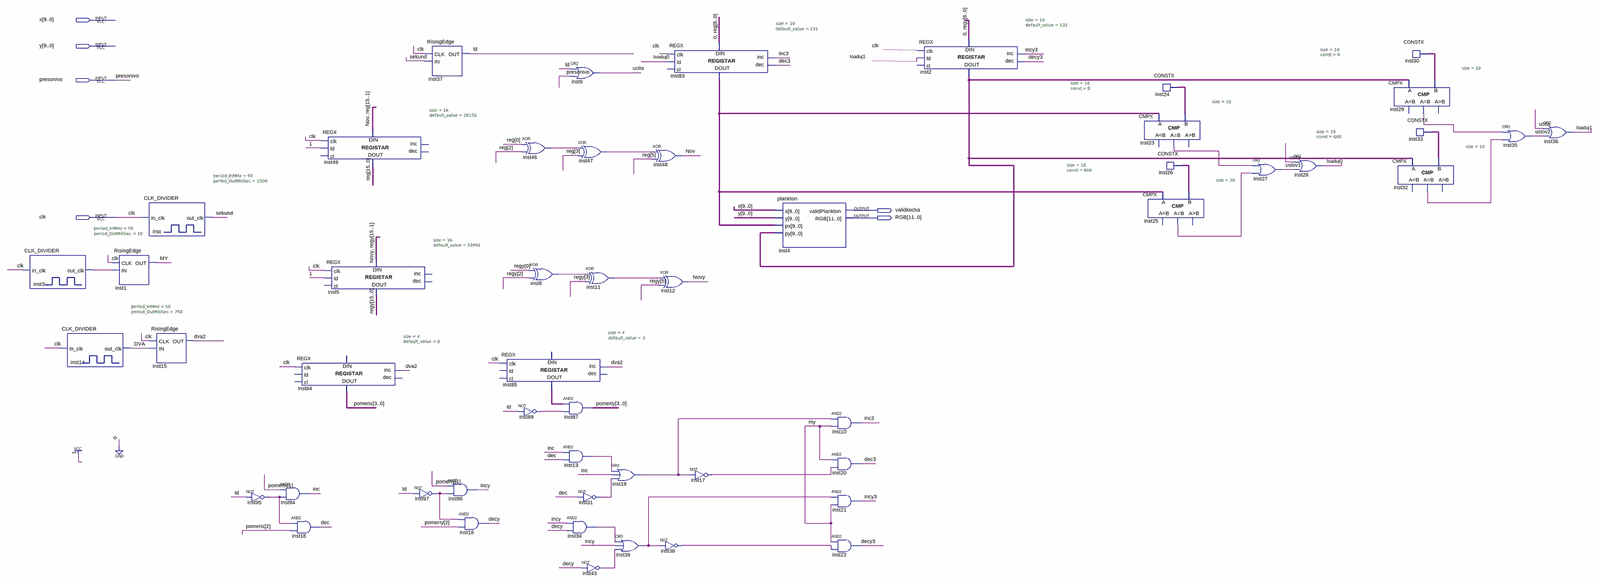
[diagram p0: schematic sheet, whole]
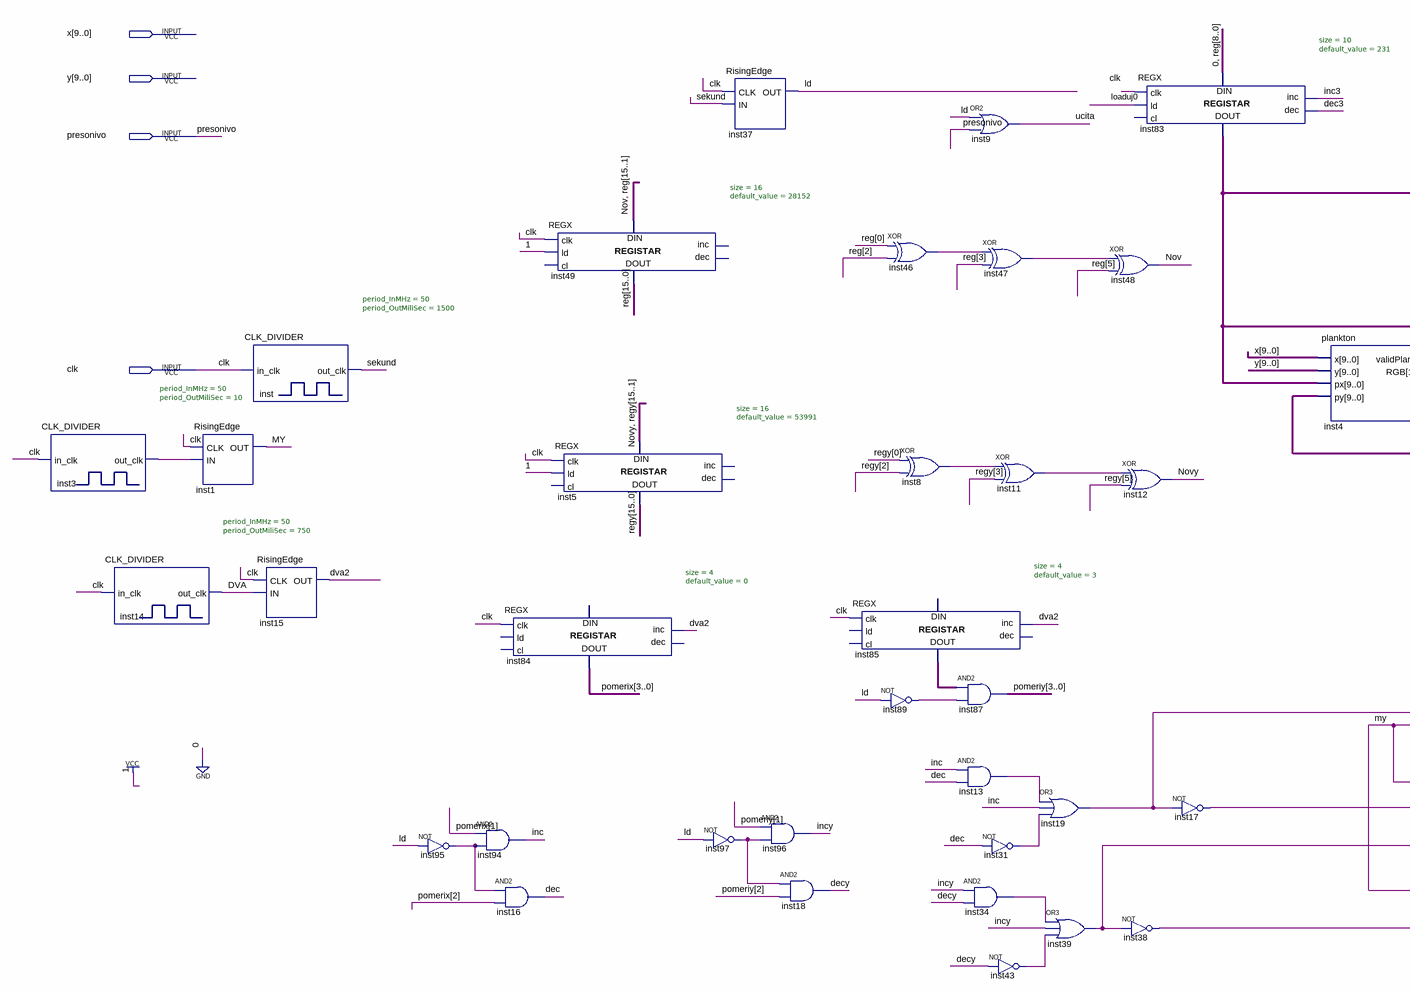
[diagram p1: schematic sheet, left part]
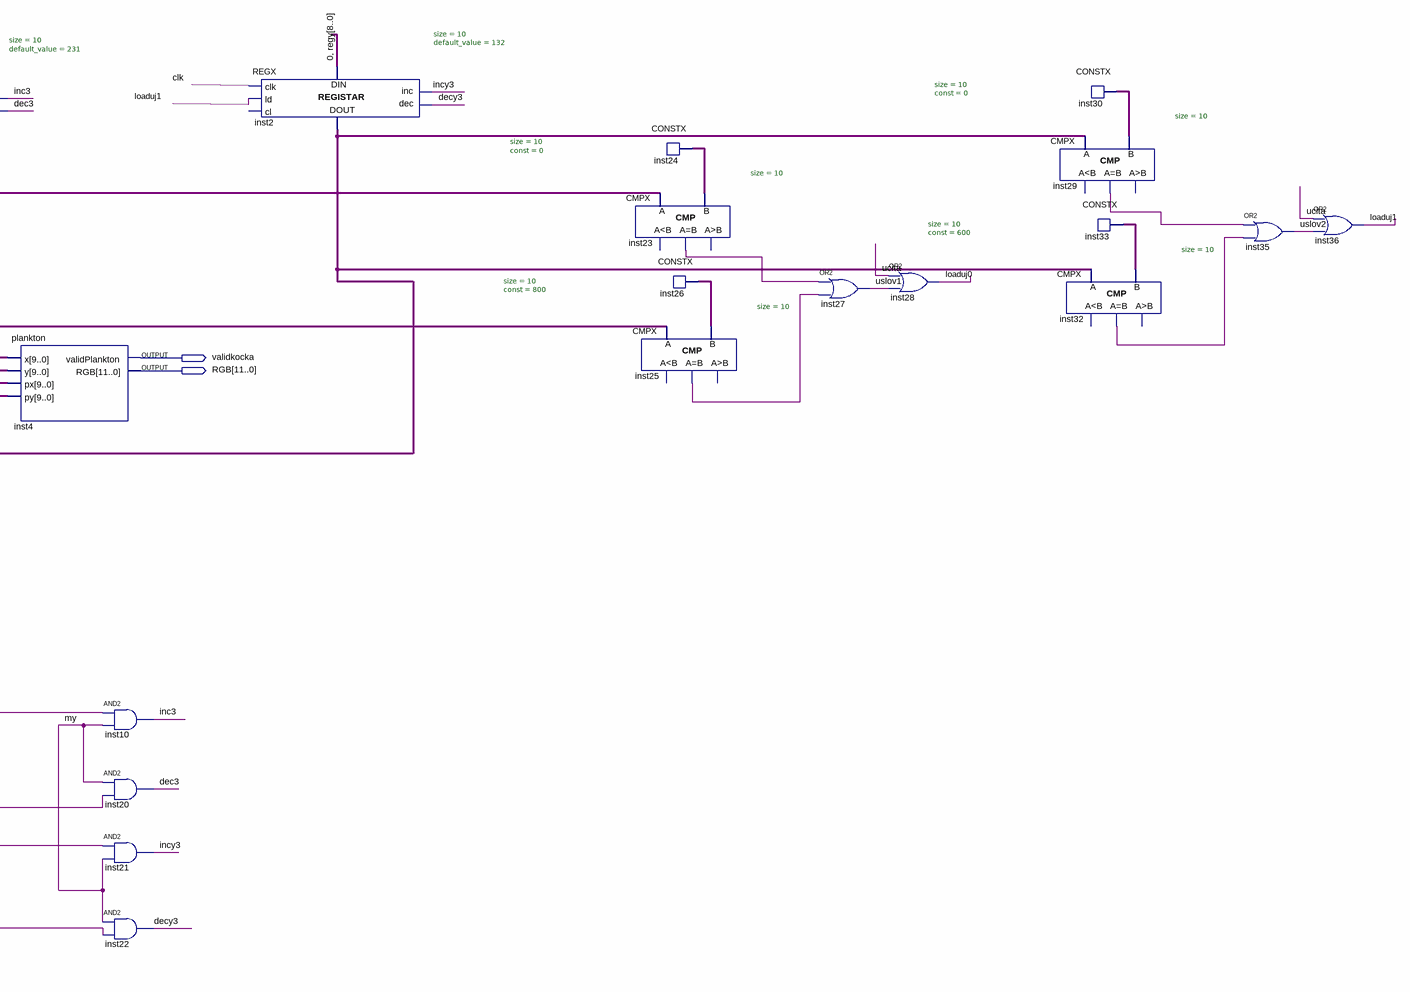
[diagram p2: schematic sheet, right part]
// Quartus schematic druginivo.bdf as structural Verilog: 52 symbols, 6 pins
module druginivo (
  input  [9:0] x,
  input  [9:0] y,
  input  presonivo,
  input  clk,
  output validkocka,
  output [11:0] RGB
);

  wire dec, dec3, decy, decy3, DVA, dva2, inc, inc3, incy, incy3, inst3_out_clk, inst8_out, inst11_out,
       inst13_out, inst17_out, inst19_out, inst23_eq, inst25_eq, inst29_eq, inst31_out, inst32_eq,
       inst34_out, inst38_out, inst39_out, inst43_out, inst46_out, inst47_out, inst89_out, inst95_out,
       inst97_out, ld, loaduj0, loaduj1, MY, Nov, Novy, sekund, ucita, uslov1, uslov2;
  wire [3:0] inst85_data_out, pomerix, pomeriy;
  wire [9:0] inst2_data_out, inst24_data, inst26_data, inst30_data, inst33_data, inst83_data_out;
  wire [15:0] \reg , regy;

  CLK_DIVIDER #(.period_InMHz(50), .period_OutMiliSec(10)) inst3 (.in_clk(clk), .out_clk(inst3_out_clk));
  CLK_DIVIDER #(.period_InMHz(50), .period_OutMiliSec(750)) inst14 (.in_clk(clk), .out_clk(DVA));
  RisingEdge inst1 (.CLK(clk), .IN(inst3_out_clk), .OUT(MY));
  CLK_DIVIDER #(.period_InMHz(50), .period_OutMiliSec(1500)) inst (.in_clk(clk), .out_clk(sekund));
  RisingEdge inst15 (.CLK(clk), .IN(DVA), .OUT(dva2));
  not inst95 (inst95_out, ld);
  and inst94 (inc, pomerix[1], inst95_out);
  REGX #(.size(4), .default_value(0)) inst84 (.clk(clk), .inc(dva2), .data_out(pomerix));  // open: ld, cl, dec, data_in
  and inst16 (dec, inst95_out, pomerix[2]);
  REGX #(.size(16), .default_value(28152)) inst49 (
    .clk(clk), .ld(1'b1), .data_in({Nov, \reg [15:1]}), .data_out(\reg ));  // open: cl, inc, dec
  REGX #(.size(16), .default_value(53991)) inst5 (
    .clk(clk), .ld(1'b1), .data_in({Novy, regy[15:1]}), .data_out(regy));  // open: cl, inc, dec
  RisingEdge inst37 (.CLK(clk), .IN(sekund), .OUT(ld));
  not inst97 (inst97_out, ld);
  and inst96 (incy, pomeriy[1], inst97_out);
  and inst18 (decy, inst97_out, pomeriy[2]);
  xor inst46 (inst46_out, \reg [0], \reg [2]);
  REGX #(.size(4), .default_value(3)) inst85 (
    .clk(clk), .inc(dva2), .data_out(inst85_data_out));  // open: ld, cl, dec, data_in
  not inst89 (inst89_out, ld);
  xor inst8 (inst8_out, regy[0], regy[2]);
  or inst9 (ucita, ld, presonivo);
  xor inst47 (inst47_out, inst46_out, \reg [3]);
  xor inst11 (inst11_out, inst8_out, regy[3]);
  assign pomeriy = inst85_data_out & {4{inst89_out}};  // AND2 inst87, 4 bits wide
  and inst13 (inst13_out, inc, dec);
  not inst31 (inst31_out, dec);
  and inst34 (inst34_out, incy, decy);
  not inst43 (inst43_out, decy);
  or inst19 (inst19_out, inst13_out, inc, inst31_out);
  or inst39 (inst39_out, inst34_out, incy, inst43_out);
  REGX #(.size(10), .default_value(231)) inst83 (
    .clk(clk), .ld(loaduj0), .inc(inc3), .dec(dec3), .data_in({1'b0, \reg [8:0]}), .data_out(inst83_data_out));  // open: cl
  xor inst48 (Nov, inst47_out, \reg [5]);
  xor inst12 (Novy, inst11_out, regy[5]);
  not inst38 (inst38_out, inst39_out);
  not inst17 (inst17_out, inst19_out);
  plankton inst4 (.x(x), .y(y), .px(inst83_data_out), .py(inst2_data_out), .validPlankton(validkocka), .RGB(RGB));
  and inst10 (inc3, inst19_out, MY);
  and inst20 (dec3, MY, inst17_out);
  and inst21 (incy3, inst39_out, MY);
  and inst22 (decy3, MY, inst38_out);
  REGX #(.size(10), .default_value(132)) inst2 (
    .clk(clk), .ld(loaduj1), .inc(incy3), .dec(decy3), .data_in({1'b0, regy[8:0]}), .data_out(inst2_data_out));  // open: cl
  CONSTX #(.size(10), .\const (0)) inst24 (.data(inst24_data));
  CMPX #(.size(10)) inst23 (.A(inst83_data_out), .B(inst24_data), .eq(inst23_eq));  // open: ls, gr
  CMPX #(.size(10)) inst25 (.A(inst83_data_out), .B(inst26_data), .eq(inst25_eq));  // open: ls, gr
  CONSTX #(.size(10), .\const (800)) inst26 (.data(inst26_data));
  or inst27 (uslov1, inst23_eq, inst25_eq);
  or inst28 (loaduj0, ucita, uslov1);
  CMPX #(.size(10)) inst29 (.A(inst2_data_out), .B(inst30_data), .eq(inst29_eq));  // open: ls, gr
  CMPX #(.size(10)) inst32 (.A(inst2_data_out), .B(inst33_data), .eq(inst32_eq));  // open: ls, gr
  CONSTX #(.size(10), .\const (0)) inst30 (.data(inst30_data));
  CONSTX #(.size(10), .\const (600)) inst33 (.data(inst33_data));
  or inst35 (uslov2, inst29_eq, inst32_eq);
  or inst36 (loaduj1, ucita, uslov2);
endmodule
